# EAGLE design POCKETBEAGLE-POD (EAGLE 9.2.2)
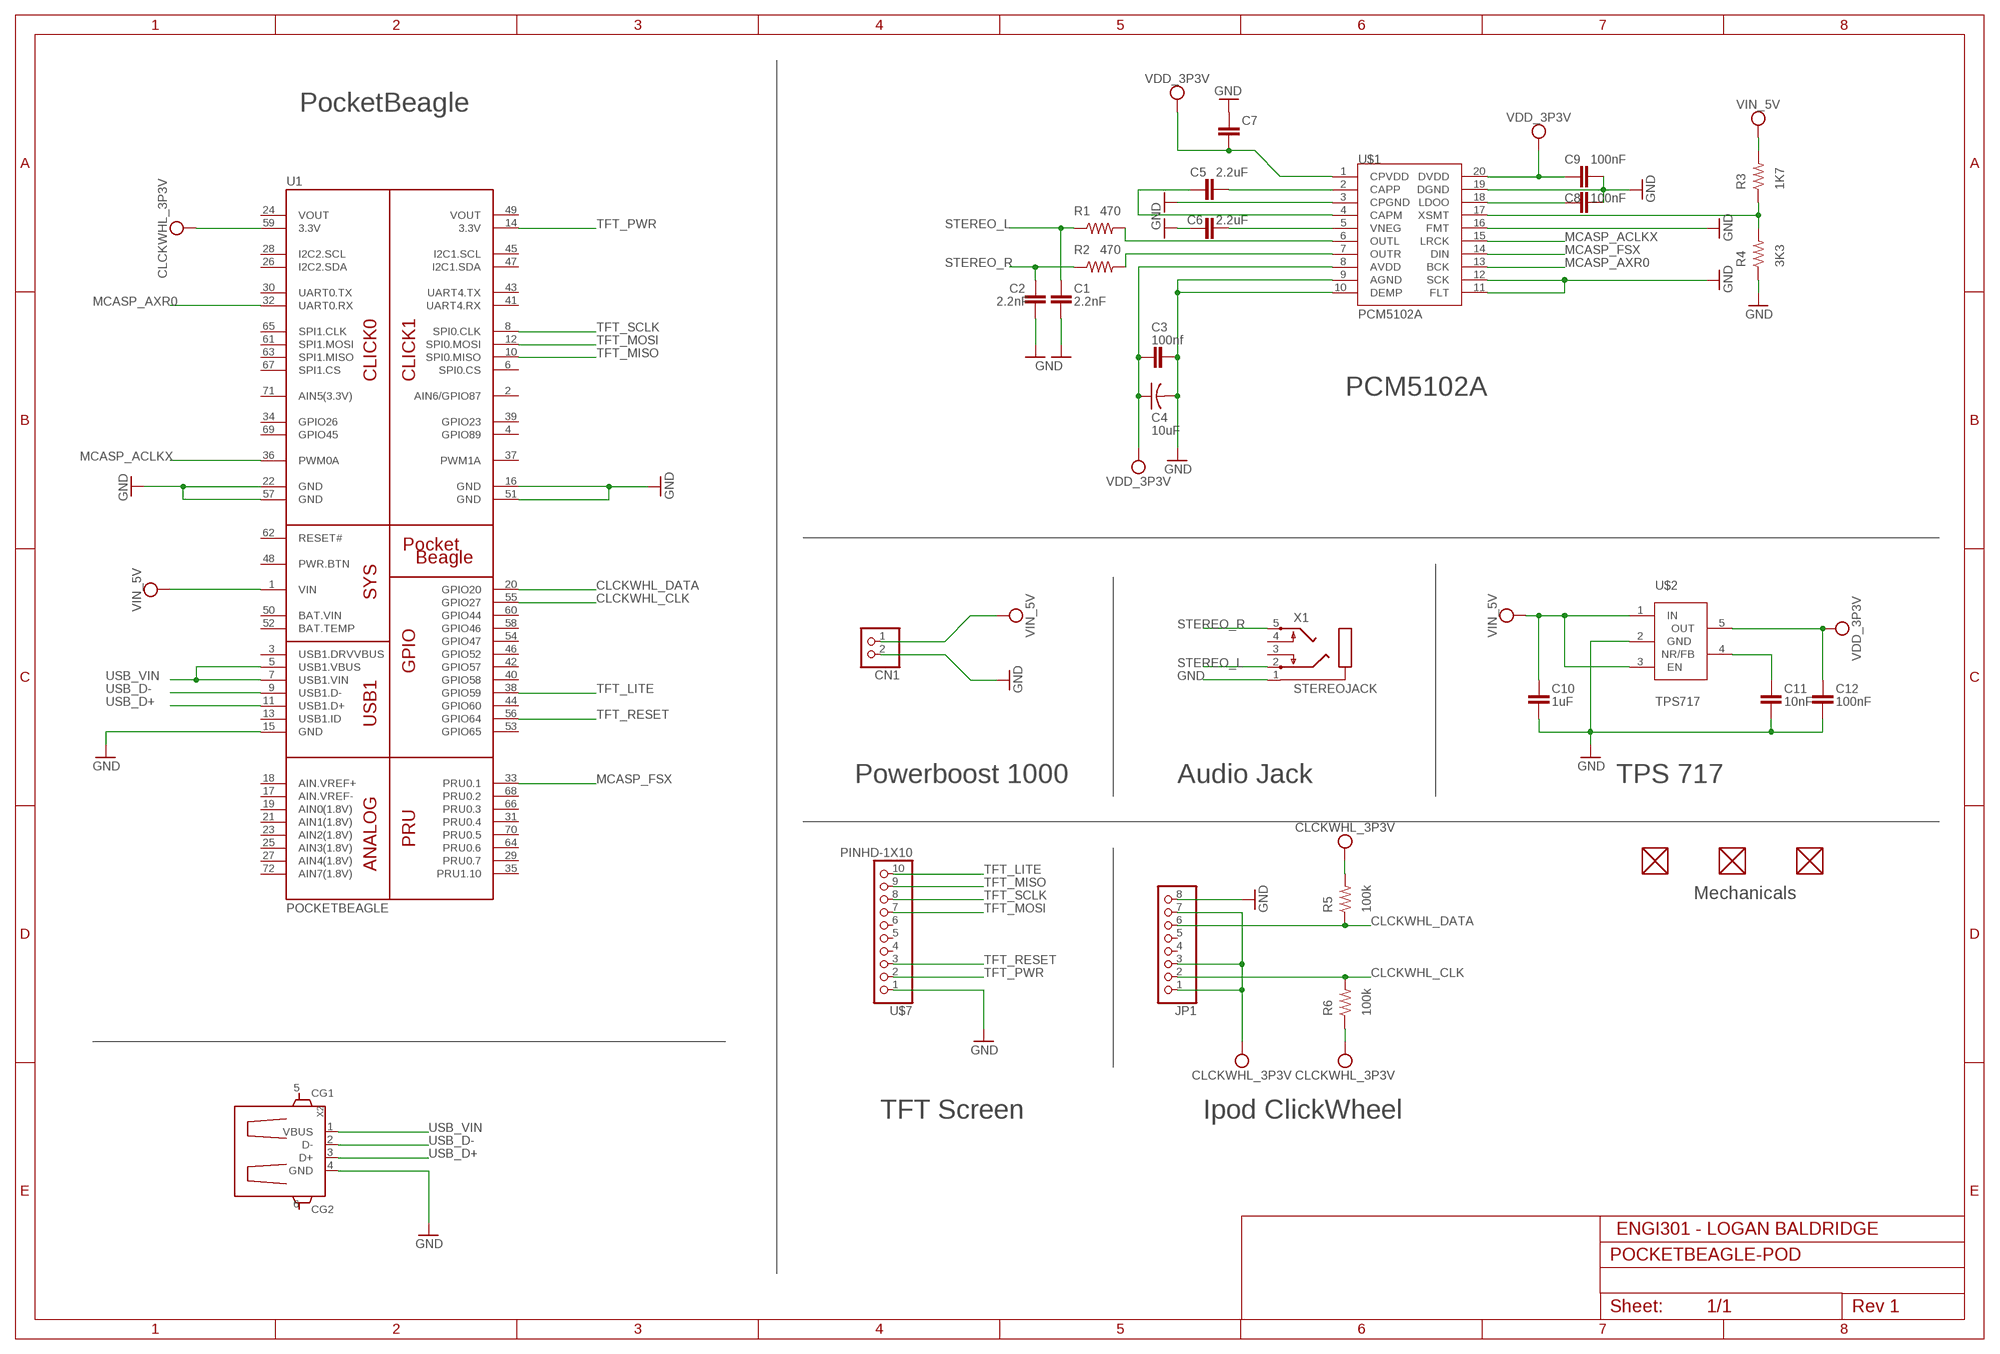
[diagram p0: schematic, sheet 1]

## Parts
C1  2.2nF  C_C0402  [C0402]
C2  2.2nF  C_C0402  [C0402]
C3  100nf  C_C0402  [C0402]
C4  10uF  C-USC1005  [C1005]
C5  2.2uF  C_C0402  [C0402]
C6  2.2uF  C_C0402  [C0402]
C7  C_C0402  [C0402]
C8  100nF  C_C0402  [C0402]
C9  100nF  C_C0402  [C0402]
C10  1uF  C_C0402  [C0402]
C11  10nF  C_C0402  [C0402]
C12  100nF  C_C0402  [C0402]
CN1  1  JST_2PIN-THM  [JST-PH-2-THM]
FUD1  FIDUCIAL  [FIDUCIAL_40MIL]
FUD2  FIDUCIAL  [FIDUCIAL_40MIL]
FUD3  FIDUCIAL  [FIDUCIAL_40MIL]
JP1  PINHD-1X8BIG  [1X08-BIG]
R1  470  R_R0402  [R0402]
R2  470  R_R0402  [R0402]
R3  1K7  R_R0402  [R0402]
R4  3K3  R_R0402  [R0402]
R5  100k  R_R0402  [R0402]
R6  100k  R_R0402  [R0402]
U1  POCKETBEAGLE  [POCKETBEAGLE]
U$1  PCM5102A  [PCM5102A]
U$2  TPS717  [TPS717]
U$7  PINHD-1X10  [1X10-BIG]
X1  STEREOJACK  [STX3100]
X2  GHI2_USB_HOST_W/CHASSIS_GND  [GHI2_USB_HOST_HORIZONTAL_W/CHASSIS_GND]

## Nets
CLCKWHL_3P3V: JP1.1 JP1.3 JP1.7 R5.2 R6.1 U1.59(3.3V)
CLCKWHL_CLK: JP1.2 R6.2 U1.55(GPIO27)
CLCKWHL_DATA: JP1.6 R5.1 U1.20(GPIO20)
GND: C1.2 C2.1 C3.2 C4.2 C6.1 C7.1 C8.2 C9.2 C10.2 C11.2 C12.2 CN1.2 JP1.8 R4.1 U1.15(GND) U1.16(GND) U1.22(GND) U1.51(GND) U1.57(GND) U$1.3(CPGND) U$1.9(AGND) U$1.10(DEMP) U$1.11(FLT) U$1.12(SCK) U$1.16(FMT) U$1.19(DGND) U$2.2(GND) U$7.1 X1.1 X2.4(GND)
MCASP_ACLKX: U1.36(PWM0A) U$1.15(LRCK)
MCASP_AXR0: U1.32(UART0.RX) U$1.13(BCK)
MCASP_FSX: U1.33(PRU0.1) U$1.14(DIN)
N$1: R1.2 U$1.6(OUTL)
N$2: R2.2 U$1.7(OUTR)
N$3: C5.1 U$1.4(CAPM)
N$4: C5.2 U$1.2(CAPP)
N$5: C6.2 U$1.5(VNEG)
N$6: R3.1 R4.2 U$1.17(XSMT)
N$7: U1.1(VIN) ; supply symbol labelled VIN_5V
N$8: C7.2 U$1.1(CPVDD) ; supply symbol labelled VDD_3P3V
N$9: C11.1 U$2.4(NR/FB)
N$10: C8.1 U$1.18(LDOO)
STEREO_L: C1.1 R1.1 X1.2
STEREO_R: C2.2 R2.1 X1.5
TFT_LITE: U1.38(GPIO59) U$7.10
TFT_MISO: U1.10(SPI0.MISO) U$7.9
TFT_MOSI: U1.12(SPI0.MOSI) U$7.7
TFT_PWR: U1.14(3.3V) U$7.2
TFT_RESET: U1.56(GPIO64) U$7.3
TFT_SCLK: U1.8(SPI0.CLK) U$7.8
USB_D+: U1.11(USB1.D+) X2.3(D+)
USB_D-: U1.9(USB1.D-) X2.2(D-)
USB_VIN: U1.5(USB1.VBUS) U1.7(USB1.VIN) X2.1(VBUS)
VDD_3P3V: C3.1 C4.1 C9.1 C12.1 U$1.8(AVDD) U$1.20(DVDD) U$2.5(OUT)
VIN_5V: C10.1 CN1.1 R3.2 U$2.1(IN) U$2.3(EN)
Unconnected: FUD1.P$1 FUD2.P$1 FUD3.P$1 JP1.4 JP1.5 U1.2(AIN6/GPIO87) U1.3(USB1.DRVVBUS) U1.4(GPIO89) U1.6(SPI0.CS) U1.13(USB1.ID) U1.17(AIN.VREF-) U1.18(AIN.VREF+) U1.19(AIN0(1.8V)) U1.21(AIN1(1.8V)) U1.23(AIN2(1.8V)) U1.25(AIN3(1.8V)) U1.26(I2C2.SDA) U1.27(AIN4(1.8V)) U1.28(I2C2.SCL) U1.29(PRU0.7) U1.30(UART0.TX) U1.31(PRU0.4) U1.34(GPIO26) U1.35(PRU1.10) U1.37(PWM1A) U1.39(GPIO23) U1.40(GPIO58) U1.41(UART4.RX) U1.42(GPIO57) U1.43(UART4.TX) U1.44(GPIO60) U1.45(I2C1.SCL) U1.46(GPIO52) U1.47(I2C1.SDA) U1.48(PWR.BTN) U1.52(BAT.TEMP) U1.53(GPIO65) U1.54(GPIO47) U1.58(GPIO46) U1.60(GPIO44) U1.61(SPI1.MOSI) U1.62(RESET#) U1.63(SPI1.MISO) U1.64(PRU0.6) U1.65(SPI1.CLK) U1.66(PRU0.3) U1.67(SPI1.CS) U1.68(PRU0.2) U1.69(GPIO45) U1.70(PRU0.5) U1.71(AIN5(3.3V)) U1.72(AIN7(1.8V)) U$7.4 U$7.5 U$7.6 X1.3 X1.4 X2.5(CG1) X2.6(CG2)

## Notes on the sheet
- PocketBeagle
- PCM5102A
- Powerboost 1000 | Audio Jack | TPS 717
- Mechanicals
- TFT Screen | Ipod ClickWheel
- ENGI301 - LOGAN BALDRIDGE
- 1/1

## Power pins joined to a net without a drawn wire
BAT.VIN: U1.50(BAT.VIN)
VOUT: U1.24(VOUT) U1.49(VOUT)

## Library data of the parts
C1-C3 C5-C12 = ENGI301:C_: Capacitor SMD. Sizes: 0402, 0603 & 0805
C4 = adafruit:C-US: CAPACITOR, American symbol
CN1 = adafruit:JST_2PIN: JST 2-Pin Connectors of various flavors SMT-RA (S2B-PH-SM4) 4UConnector #17311 SMT (B2B-PH-SM4) THM-RA (S2B-PH) THM (B2B-PH)
FUD1-FUD3 = ENGI301:FIDUCIAL
JP1 = adafruit:PINHD-1X8: PIN HEADER
R1-R6 = ENGI301:R_: RESISTOR, American symbol
U1 = ENGI301:POCKETBEAGLE
U$1 = ENGI301:PCM5102A: TI PCM5102A By Logan Baldridge
U$2 = ENGI301:TPS717: TI TPS717 DCK Package 5-pin SC70 By Logan Baldridge
U$7 = adafruit:PINHD-1X10: Pin header 1x10 0.1" spacing With round pins
X1 = adafruit:STEREOJACK: MIC/HEADPHONE JACK Stereo jack with two switches. Kycon STX3100, CUI SJ1-3555NG and/or 4UCon 05544
X2 = BeagleBone_Black_Wireless:GHI2_USB_HOST_W/CHASSIS_GND

## Board
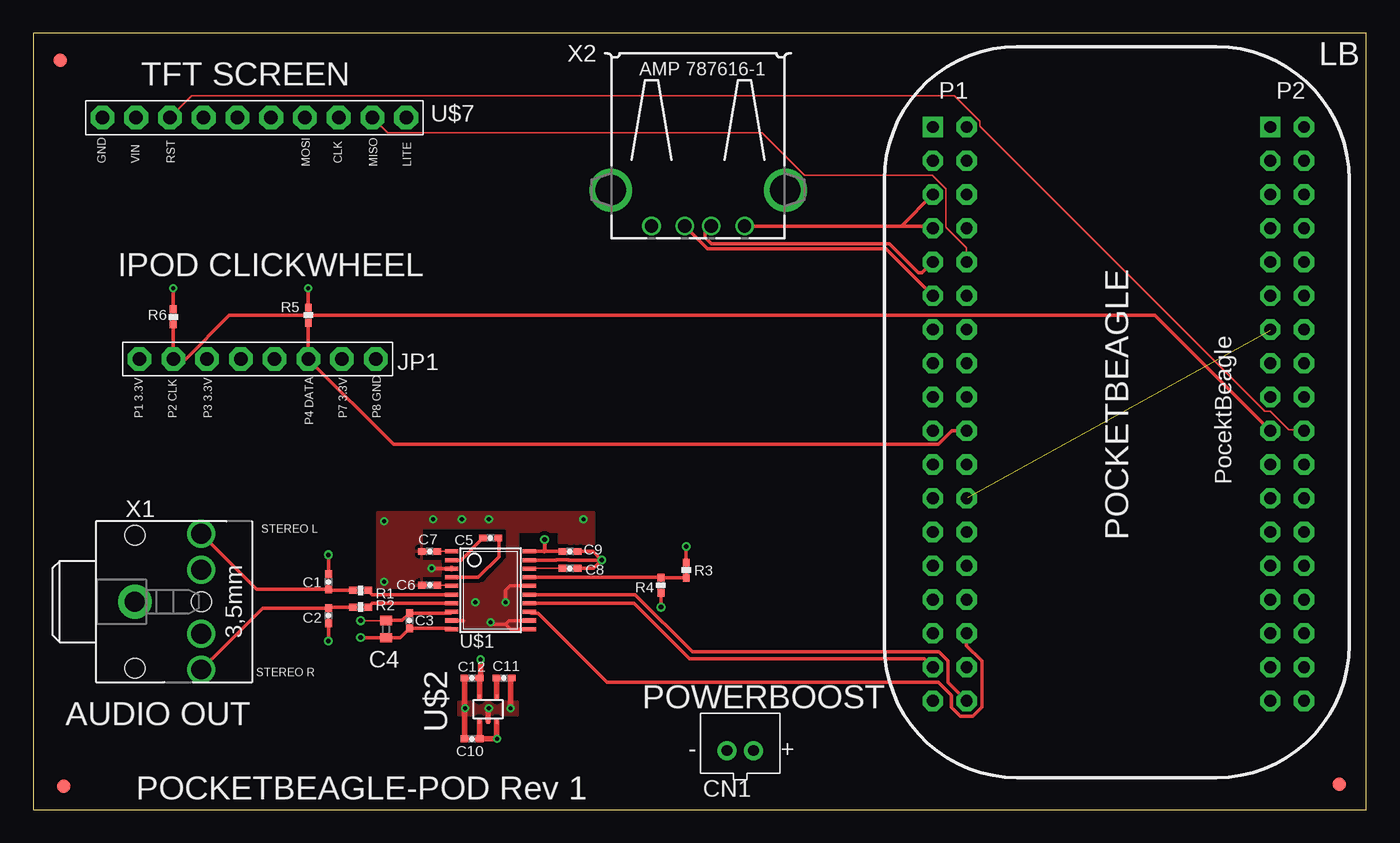
[diagram p1: board, top side]
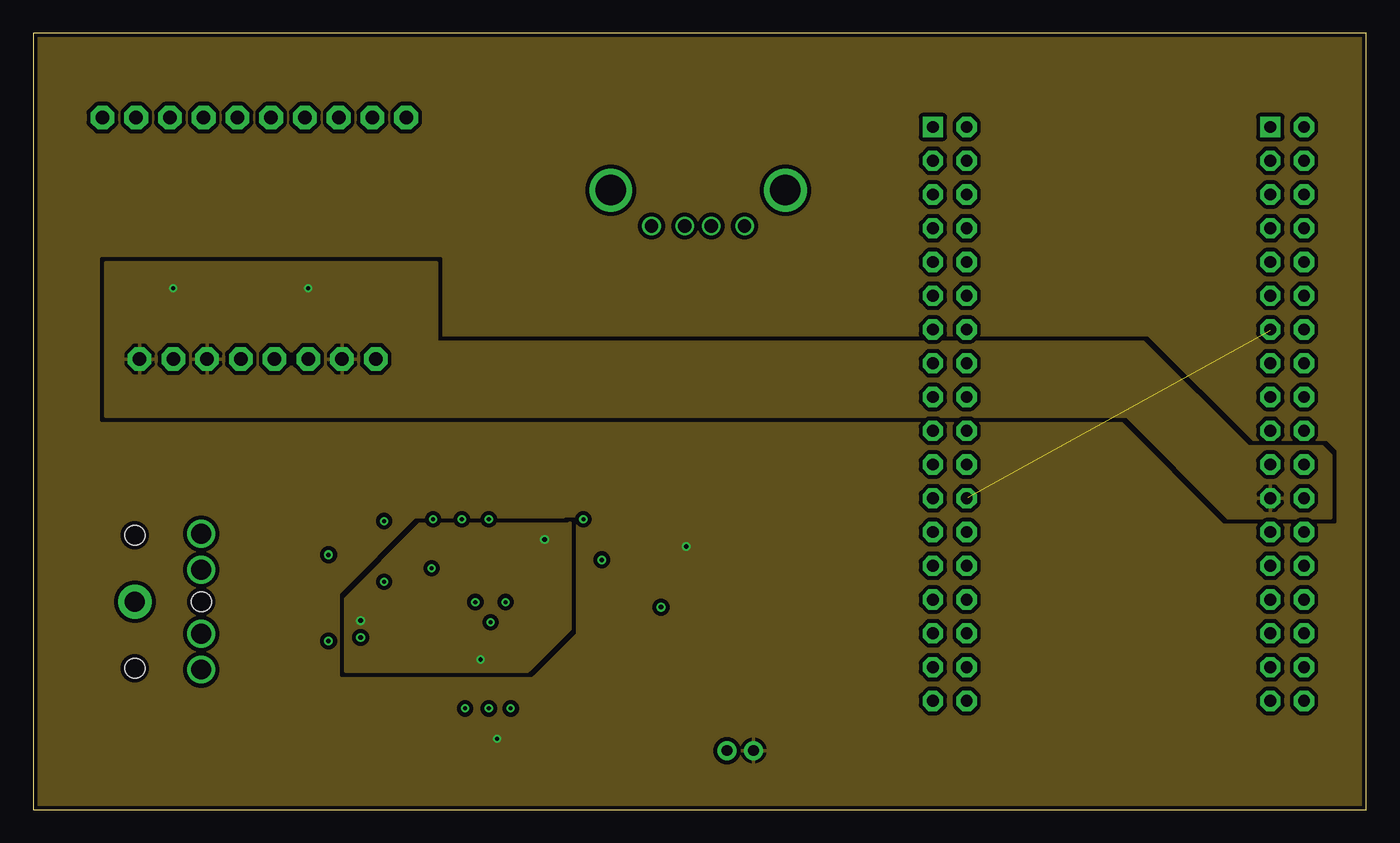
[diagram p2: board, inner layer Route2]
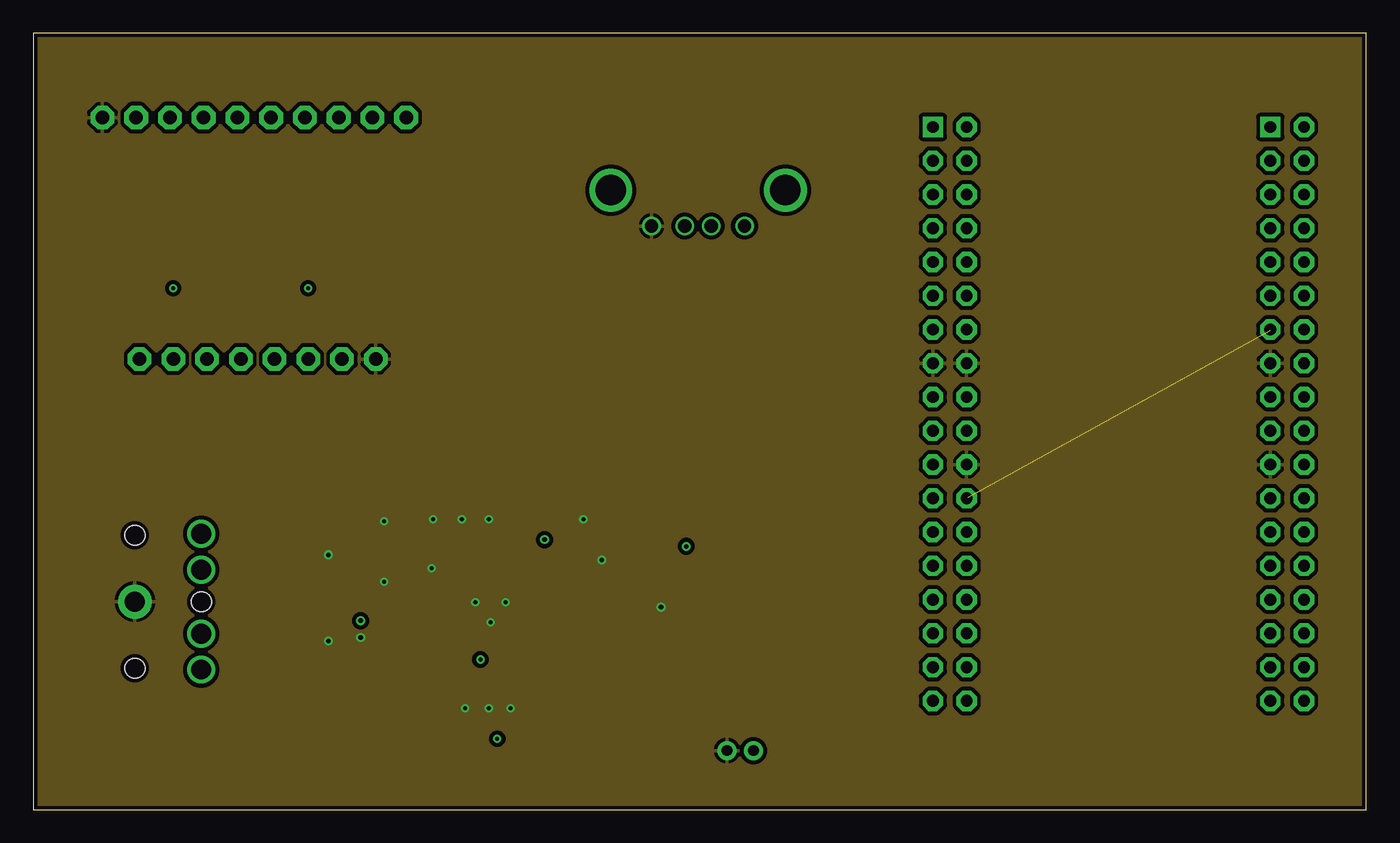
[diagram p3: board, inner layer Route15]
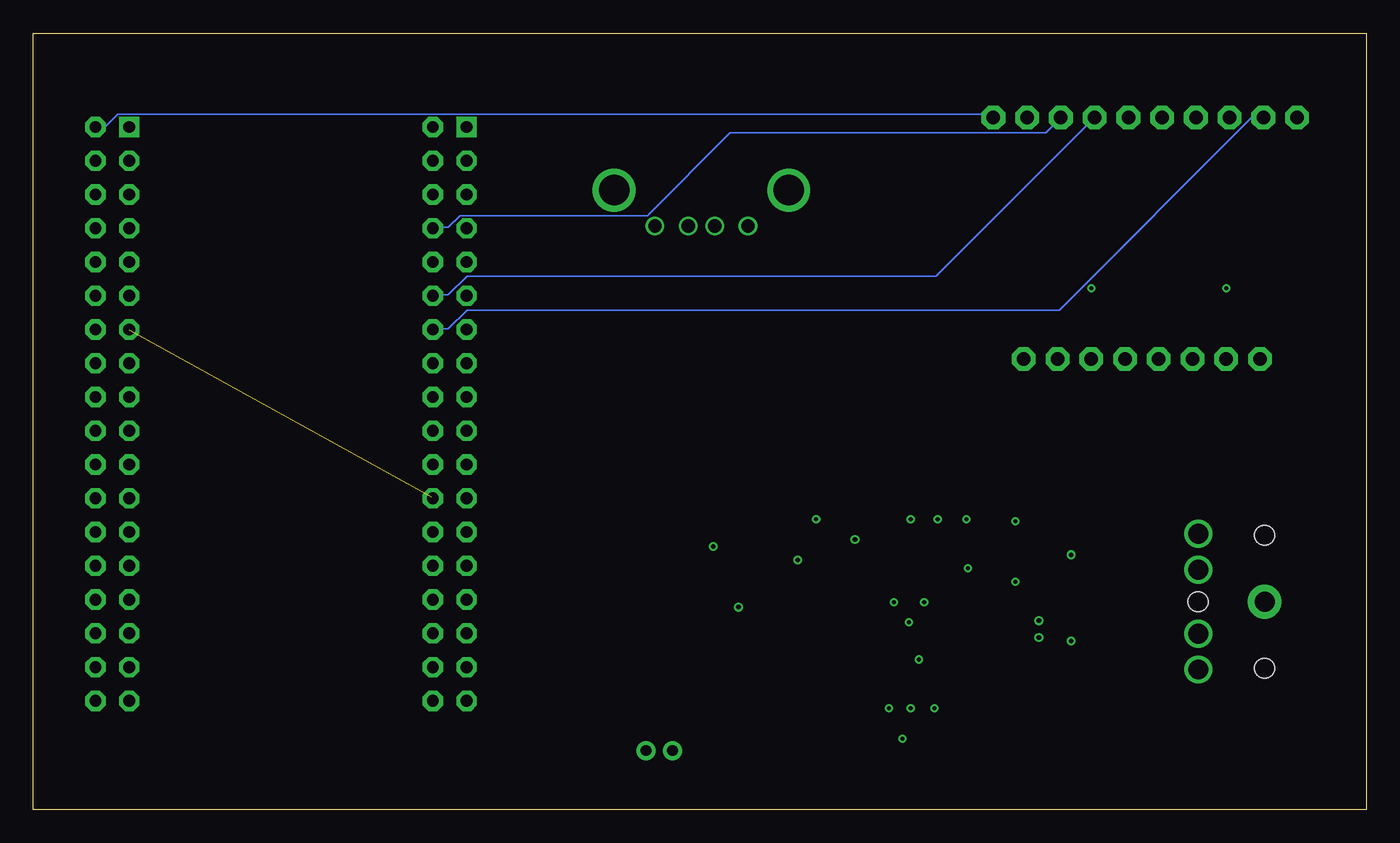
[diagram p4: board, bottom side, seen from below]

Size 100.33 x 58.42 mm. Coordinates in mm from the lower left corner, seen from the top.
Outline: 0,0 100.33,0 100.33,58.42 0,58.42 0,0
Copper layers (1*2*15*16): Top 0.035mm / dielectric 0.23mm / Route2 0.035mm / dielectric 0.93mm / Route15 0.035mm / dielectric 0.23mm / Bottom 0.035mm
Design rules "ENGI301_4lyr *": minimum track width 5mil, minimum drill 12mil, track to track 5mil, track to pad 5mil, pad to pad 5mil, via to via 5mil, smd to smd 5mil, copper to edge 10mil, drill to drill 12mil, minimum pad ring 6mil, minimum via ring 6mil, stop-mask expansion 3mil, vias tented up to drill 25mil, thermal gap 10mil

### Footprints (pad centres in the part's own frame; a part is rotated, then mirrored left to right if it is on the bottom)
C0402 = smd 0.61 x 0.508: 1 -0.559,0; 2 0.559,0
C1005 = smd 0.7 x 0.9: 1 -0.65,0; 2 0.65,0
JST-PH-2-THM = drill 0.8 pad 1.422: 1 1,0; 2 -1,0
FIDUCIAL_40MIL = smd 1.016 x 1.016: P$1 0,0
1X08-BIG = drill 1.016 pad 1.778 octagon: 1 -8.89,0; 2 -6.35,0; 3 -3.81,0; 4 -1.27,0; 5 1.27,0; 6 3.81,0; 7 6.35,0; 8 8.89,0
R0402 = smd 0.61 x 0.508: 1 -0.559,0; 2 0.559,0
POCKETBEAGLE = drill 0.889 pad 1.524 square: 1 5.91,3.53; 37 5.91,28.93 | drill 0.889 pad 1.524 octagon: 2 5.91,6.07; 3 8.45,3.53; 4 8.45,6.07; 5 10.99,3.53; 6 10.99,6.07; 7 13.53,3.53; 8 13.53,6.07; 9 16.07,3.53; 10 16.07,6.07; 11 18.61,3.53; 12 18.61,6.07; 13 21.15,3.53; 14 21.15,6.07; 15 23.69,3.53; 16 23.69,6.07; 17 26.23,3.53; 18 26.23,6.07; 19 28.77,3.53; 20 28.77,6.07; 21 31.31,3.53; 22 31.31,6.07; 23 33.85,3.53; 24 33.85,6.07; 25 36.39,3.53; 26 36.39,6.07; 27 38.93,3.53; 28 38.93,6.07; 29 41.47,3.53; 30 41.47,6.07; 31 44.01,3.53; 32 44.01,6.07; 33 46.55,3.53; 34 46.55,6.07; 35 49.09,3.53; 36 49.09,6.07; 38 5.91,31.47; 39 8.45,28.93; 40 8.45,31.47; 41 10.99,28.93; 42 10.99,31.47; 43 13.53,28.93; 44 13.53,31.47; 45 16.07,28.93; 46 16.07,31.47; 47 18.61,28.93; 48 18.61,31.47; 49 21.15,28.93; 50 21.15,31.47; 51 23.69,28.93; 52 23.69,31.47; 53 26.23,28.93; 54 26.23,31.47; 55 28.77,28.93; 56 28.77,31.47; 57 31.31,28.93; 58 31.31,31.47; 59 33.85,28.93; 60 33.85,31.47; 61 36.39,28.93; 62 36.39,31.47; 63 38.93,28.93; 64 38.93,31.47; 65 41.47,28.93; 66 41.47,31.47; 67 44.01,28.93; 68 44.01,31.47; 69 46.55,28.93; 70 46.55,31.47; 71 49.09,28.93; 72 49.09,31.47
PCM5102A = smd 0.991 x 0.305: 1 2.918,-2.925; 2 2.918,-2.275; 3 2.918,-1.625; 4 2.918,-0.975; 5 2.918,-0.325; 6 2.918,0.325; 7 2.918,0.975; 8 2.918,1.625; 9 2.918,2.275; 10 2.918,2.925; 11 -2.918,2.925; 12 -2.918,2.275; 13 -2.918,1.625; 14 -2.918,0.975; 15 -2.918,0.325; 16 -2.918,-0.325; 17 -2.918,-0.975; 18 -2.918,-1.625; 19 -2.918,-2.275; 20 -2.918,-2.925
TPS717 = smd 0.406 x 0.203: 1 -0.2,1.725; 2 -0.2,1.075; 3 -0.2,0.425; 4 1.6,0.425; 5 1.6,1.725
1X10-BIG = drill 1.016 pad 1.778 octagon: 1 -11.43,0; 2 -8.89,0; 3 -6.35,0; 4 -3.81,0; 5 -1.27,0; 6 1.27,0; 7 3.81,0; 8 6.35,0; 9 8.89,0; 10 11.43,0
STX3100 = drill 1.5 pad 2.54: 1 2.7,-0.1 | drill 1.5: 2 7.7,5; 3 7.7,2.3; 4 7.7,-2.5; 5 7.7,-5.2 | hole 1.5: 2.7,4.9; 2.7,-5.1; 7.7,-0.1
GHI2_USB_HOST_HORIZONTAL_W/CHASSIS_GND = drill 1: 1 -3.5,12.99; 2 -1,12.99; 3 1,12.99; 4 3.5,12.99 | drill 2.3: 5 -6.57,10.28; 6 6.57,10.28

### Placement (x,y rotation side)
C1  22.23,17.14 90 top
C2  22.23,14.61 90 top
C3  28.32,14.22 270 top
C4  26.54,13.59 270 top
C5  34.42,20.45 180 top
C6  29.84,16.89 0 top
C7  29.84,19.43 0 top
C8  40.39,18.16 0 top
C9  40.39,19.43 0 top
C10  33.02,5.33 180 top
C11  35.43,9.91 0 top
C12  33.02,9.91 180 top
CN1  53.21,4.45 0 top
FUD1  2.29,1.78 0 top
FUD2  2.03,56.39 0 top
FUD3  98.3,1.91 0 top
JP1  16.89,33.91 0 top
R1  24.64,16.51 0 top
R2  24.64,15.24 0 top
R3  49.15,18.03 90 top
R4  47.24,16.89 90 top
R5  20.7,37.21 90 top
R6  10.54,37.08 270 top
U1  64.18,57.28 270 top
U$1  34.42,16.51 180 top
U$2  35.31,6.86 90 top
U$7  16.64,52.07 0 top
X1  4.95,15.75 0 top
X2  50.04,56.9 180 top

### Tracks (layer width: path | path; a pad name or v marks a point on that pad's centre or on a via)
CLCKWHL_3P3V  (via drill 0.3 pad 0.61)
  Top 0.254: v10.54,39.24 R6.1 | v20.7,39.24 R5.2
  pour Route2 (isolate 0.305): 5.46,29.59 82.3,29.59 89.92,21.97 97.66,21.97 97.66,26.67 97.03,27.3 91.44,27.3 83.57,35.18 30.35,35.18 30.35,41.15 5.46,41.15
CLCKWHL_CLK
  Top 0.254: R6.2 JP1.2 11.46,33.91 14.77,37.21 84.4,37.21 U1.55
CLCKWHL_DATA
  Top 0.254: R5.1 JP1.6 27.12,27.49 68.13,27.49 69.14,28.51 U1.20
GND  (via drill 0.3, 0.3 pad 0.61, 0.35)
  Top 0.254: C2.1 v22.23,12.7 | C1.2 v22.23,19.18 | 7.21,15.65 X1.1 7.14,15.65 | U$1.19 39.35,18.79 39.37,18.8 40.29,18.8 40.3,18.79 42.79,18.79 | C8.2 42.16,18.16 42.79,18.79 | 42.79,18.79 v42.8,18.8 | C9.2 42.14,19.43 42.79,18.79 | U$1.10 31.42,13.66 C3.2 27.59,12.94 C4.2 24.65,12.94 v24.64,12.95 | 30.66,18.15 30.66,18.16 | 30.66,18.16 30.73,18.16 | 32.26,14.22 32.38,14.22 32.37,14.23 U$1.9 | R4.1 v47.24,15.24 | U$1.11 35.95,13.59 35.56,13.97 | U$1.12 35.83,14.23 35.56,13.97 | 35.56,13.97 34.54,13.97 v34.42,14.1 | U$1.16 35.88,16.84 35.56,16.51 v35.56,15.62 | U$1.3 30,18.14 | 30,18.14 v29.97,18.16 | 30.66,18.16 30.02,18.16 30,18.14
  Top 0.406: C12.2 32.46,7.67 | 32.46,7.67 v32.51,7.62 | U$2.2 34.23,7.56 v34.29,7.62 | v35.94,7.62 35.94,9.86 C11.2 | C10.2 32.46,7.67 | U$1.3 31.47,18.16
  other vias: 26.42,17.14 33.27,15.62 26.42,21.72 30.1,21.84 32.26,21.84 34.29,21.84 41.4,21.84
  pour Route15 (isolate 0.305, rank 6): -1.27,59.69 -1.27,-1.27 101.6,-1.27 101.6,59.69
  pour Top (isolate 0.305): 32.38,13.59 36.45,13.59 36.45,20.95 39.62,20.95 39.62,20.07 42.16,20.07 42.16,22.35 25.91,22.35 25.91,16.64 29.21,16.64 29.21,17.65 30.73,17.65 30.73,18.67 29.21,18.67 29.21,21.21 35.69,21.21 35.69,18.92 33.91,17.02 32.38,17.02
  pour Top (isolate 0.305): 34.04,7.11 32,7.11 32,8.13 36.45,8.13 36.45,7.11 34.54,7.11
MCASP_ACLKX
  Top 0.254: U1.36 68.85,9.59 68.85,11.2 68.18,11.87 49.61,11.87 45.3,16.18 U$1.15
MCASP_AXR0
  Top 0.254: U$1.13 37.45,14.77 37.99,14.77 43.17,9.59 68.13,9.59 69.1,8.61 69.1,7.71 69.77,7.04 70.72,7.04 71.39,7.71 71.39,11.2 70.25,12.34 U1.32
MCASP_FSX
  Top 0.254: U$1.14 45.23,15.54 49.4,11.36 67.07,11.36 U1.33
N$1
  Top 0.254: U$1.6 25.52,16.18 R1.2
N$2
  Top 0.254: U$1.7 25.49,15.54 R2.2
N$3
  Top 0.254: U$1.4 33.49,17.48 35.05,19.05 35.05,20.37 C5.1
N$4
  Top 0.254: C5.2 32.2,18.79 U$1.2
N$5
  Top 0.127: C6.2 31.5,16.89 U$1.5
N$6
  Top 0.254: U$1.17 47.21,17.48 R4.2 49.12,17.45 R3.1
N$8
  Top 0.127: C7.2 U$1.1
N$9
  Top 0.406: U$2.4 C11.1
  Top 0.508: C11.1 34.88,9.9
N$10
  Top 0.127: C8.1 37.34,18.16 U$1.18
STEREO_L
  Top 0.254: R1.1 22.3,16.51 C1.1 16.82,16.59 X1.2
STEREO_R
  Top 0.254: R2.1 22.3,15.24 C2.2 17.27,15.16 X1.5
TFT_LITE
  Bottom 0.127: U$7.10 28.32,52.32 93.98,52.32 94.87,51.44 95.63,51.44 U1.38
TFT_MISO
  Top 0.127: U$7.9 26.67,50.93 54.86,50.93 58.04,47.75 67.69,47.75 68.71,46.74 68.71,43.81 70.23,42.29 70.23,41.27 U1.10
TFT_MOSI
  Bottom 0.127: U$7.7 32.38,40.13 67.69,40.13 69.09,38.73 70.23,38.73 U1.12
TFT_PWR
  Bottom 0.127: U$7.2 8.64,52.07 23.11,37.59 67.69,37.59 69.09,36.2 70.23,36.2 U1.14
TFT_RESET
  Top 0.127: U$7.3 11.94,53.72 69.34,53.72 71.25,51.82 71.25,51.44 92.71,29.97 93.09,29.97 94.49,28.57 95.63,28.57 U1.56
TFT_SCLK
  Bottom 0.127: U$7.8 24.13,50.93 47.88,50.93 54.1,44.7 68.2,44.7 69.09,43.81 70.23,43.81 U1.8
USB_D+
  Top 0.254: U1.11 64.19,42.19 50.75,42.19 X2.3
USB_D-
  Top 0.254: U1.9 66.89,40.39 66.62,40.39 64.44,42.57 51.04,42.57 50.55,43.06 50.55,43.42 X2.2
USB_VIN
  Top 0.254: U1.7 67.55,43.91 X2.1 65.33,43.91 U1.5
VDD_3P3V  (via drill 0.3 pad 0.61, 0.35)
  Top 0.127: v24.64,14.22 26.42,14.22 C4.1
  Top 0.254: U$1.8 31.4,14.78 C3.1 27.78,14.24 C4.1 | C9.1 38.48,19.43 U$1.20 | 33.66,9.98 C12.1
  Top 0.305: v38.48,20.32 38.48,19.43
  Top 0.406: U$2.5 C12.1 | v33.66,11.3 33.66,9.98
  Top 0.508: C12.1
  pour Route2 (isolate 0.305): 31.88,10.41 23.5,10.41 23.5,15.88 29.08,21.46 40.26,21.46 40.39,21.59 40.39,13.59 37.34,10.54 37.21,10.41
VIN_5V  (via drill 0.3 pad 0.61, 0.35)
  Top 0.254: v49.15,19.81 R3.2
  Top 0.406: U$2.1 C10.1 v34.92,5.33 34.88,5.38 U$2.3
  pour Route2 (isolate 0.305, rank 6): -2.54,60.96 -2.54,-2.54 102.87,-2.54 102.87,60.96
VOUT  (1 unrouted)
  Bottom 0.127: 70.36,23.5 U1.24 | 93.09,36.07 U1.49

### Text on the board
tPlace: LB | TFT SCREEN | GND | VIN | RST | CLK | MOSI | MISO | LITE | IPOD CLICKWHEEL | P1 3.3V | P2 CLK | P3 3.3V | P4 DATA | P7 3.3V | P8 GND | STEREO L | POCKETBEAGLE | STEREO R | POWERBOOST | AUDIO OUT | POCKETBEAGLE-POD Rev 1